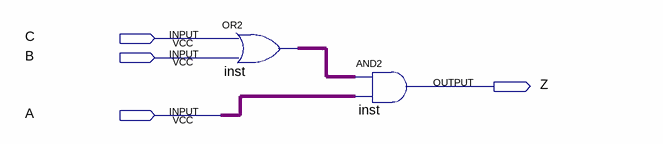
[diagram p0: schematic sheet]
// Quartus schematic lab3.bdf as structural Verilog: 2 symbols, 4 pins
module lab3 (
  input  C,
  input  B,
  input  A,
  output Z
);

  wire inst_out;

  or inst (inst_out, C, B);
  and inst_dup2 (Z, inst_out, A);
endmodule
